# EasyEDA schematic 8 Outputs Card with I2C.json
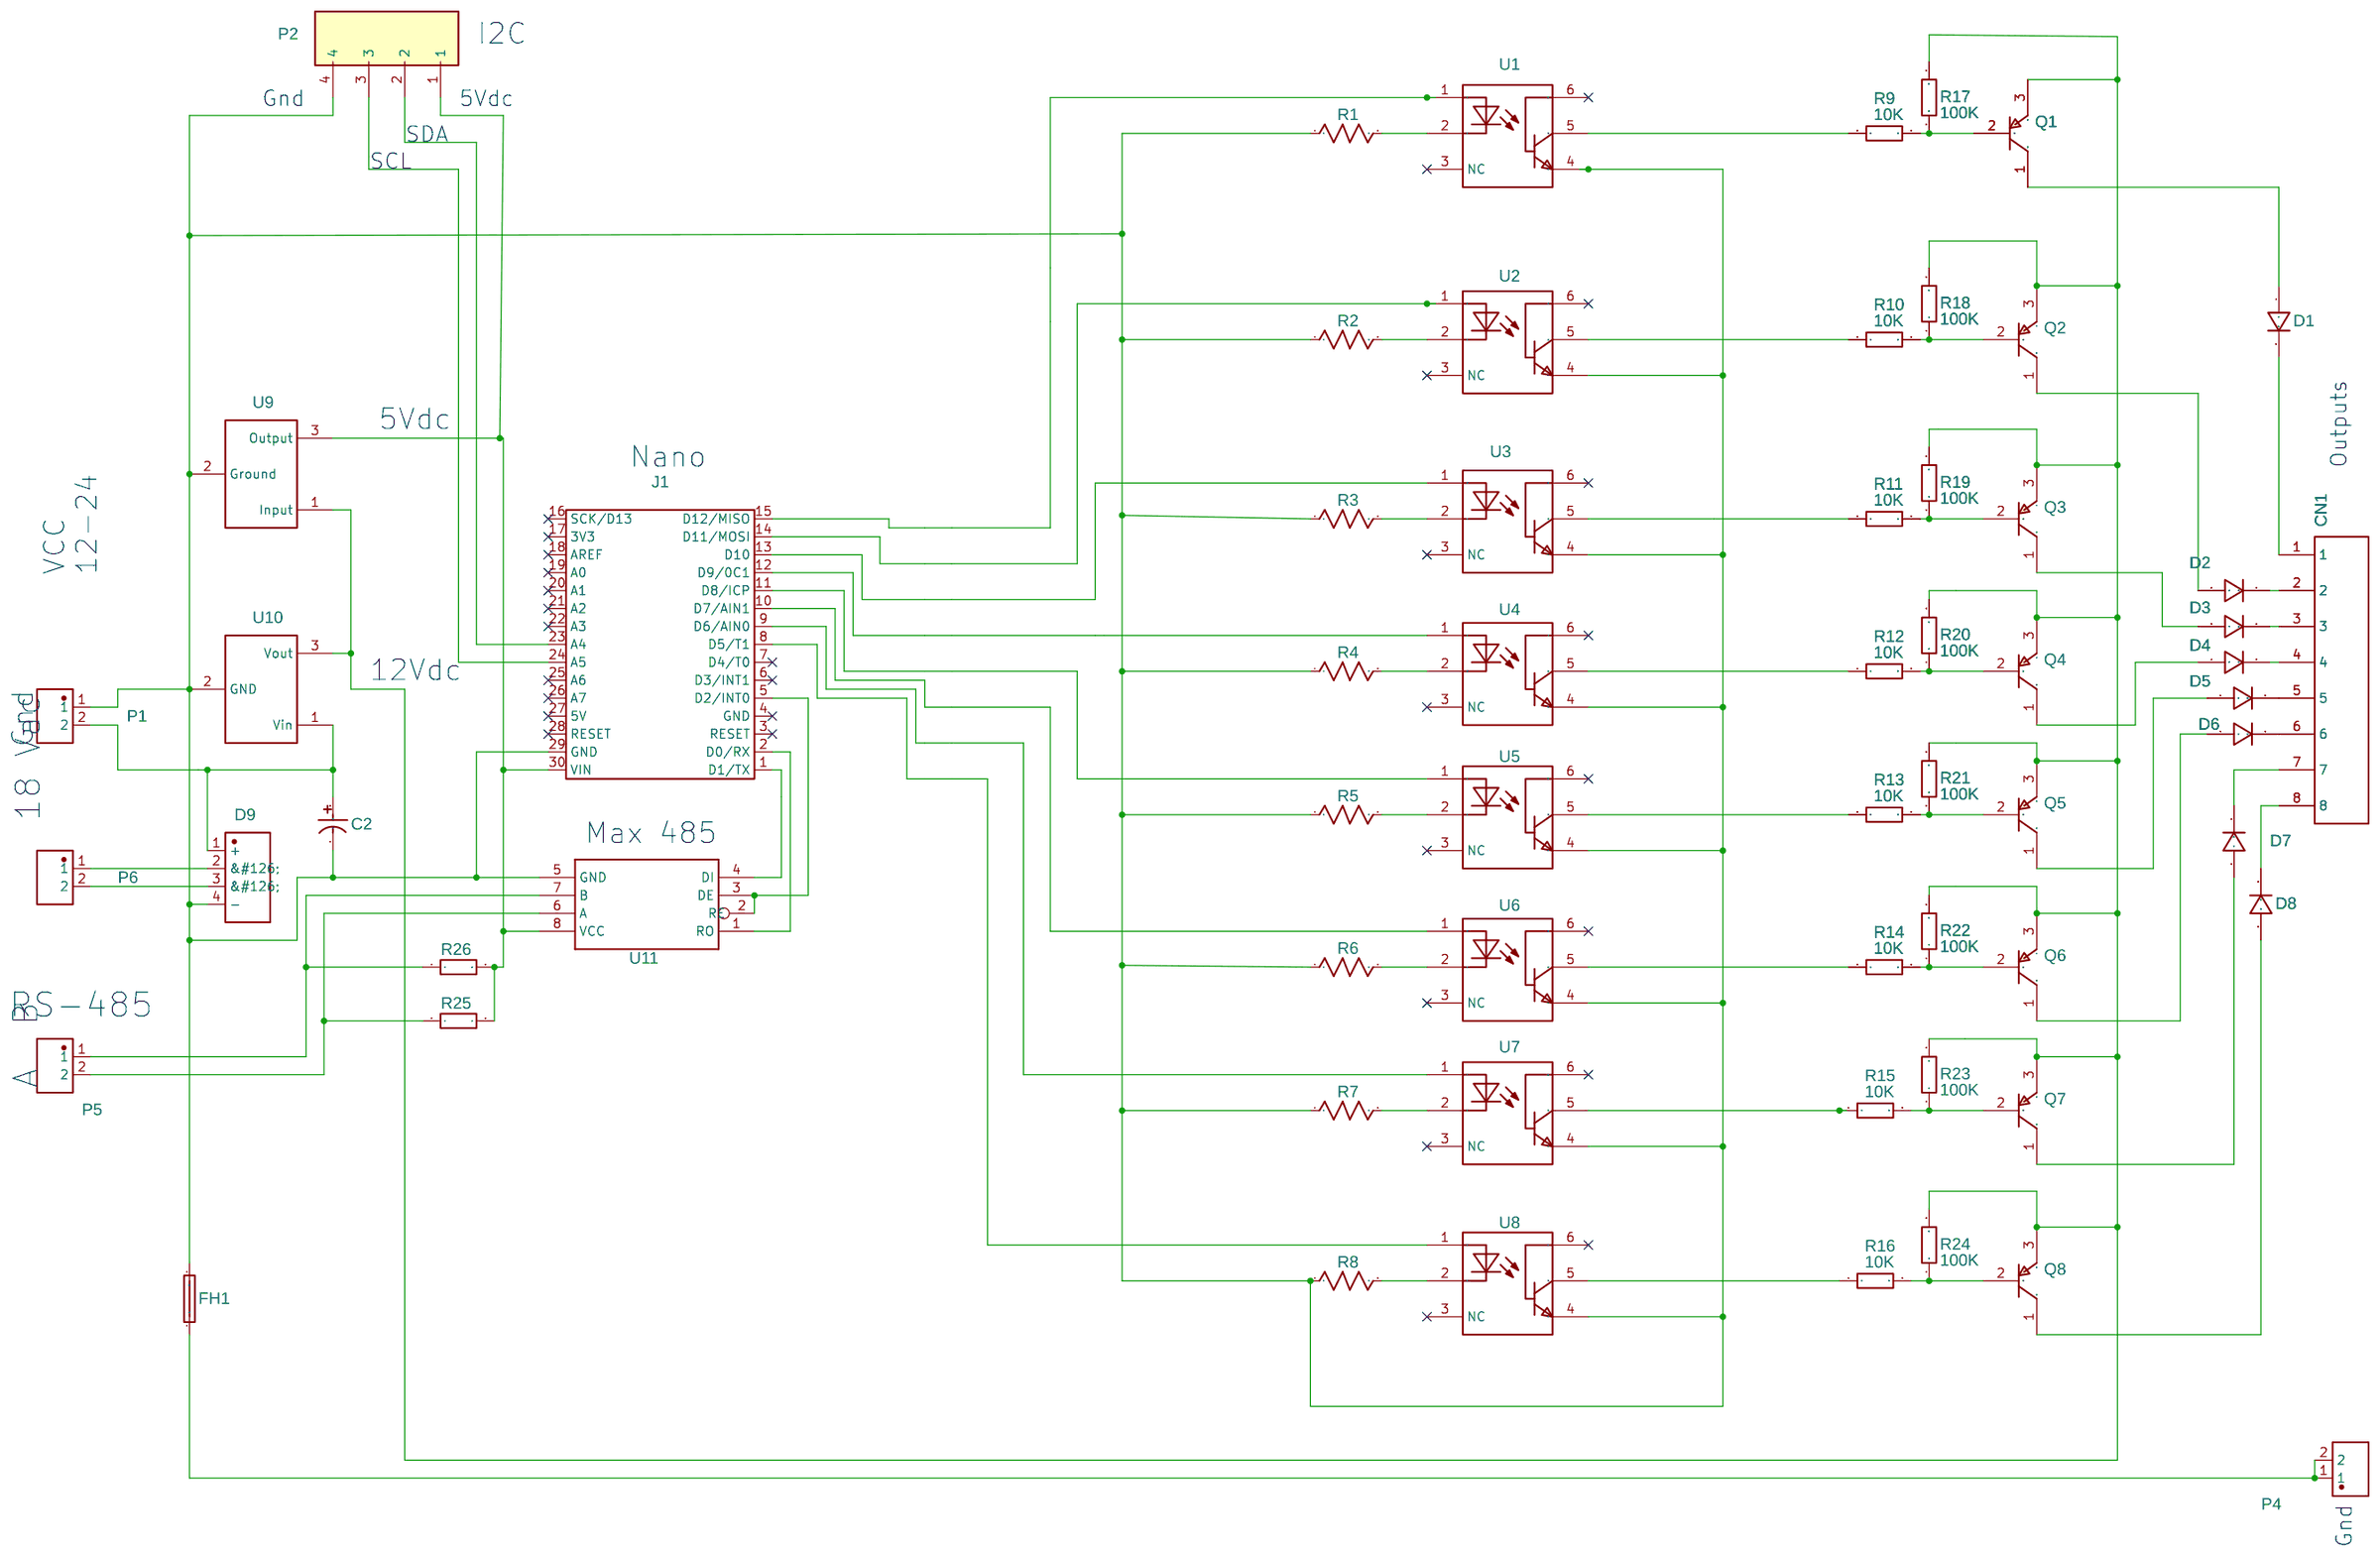
[diagram p0: schematic sheet]

## Parts
C2  470uF  [CAP-TH_BD16.0-P7.50-D1.2-FD]
CN1  WJ25C-B-7.62-8P-13-00A  [WJ25C-B-7.62-8P]
D1  1N4001  [DO-41]
D2  1N4001  [DO-41]
D3  1N4001  [DO-41]
D4  1N4001  [DO-41]
D5  1N4001  [DO-41]
D6  1N4001  [DO-41]
D7  1N4001  [DO-41]
D8  1N4001  [DO-41]
D9  D50SB100  [DIO-BG-TH_DXXSBXX]
FH1  64600001003  [FUSE-2P-25.8X9.0]
J1  Arduino_Nano_Header  [DIP-30_L43.18-W15.24-ARDUINONANO]
P1  WJ25C-B-2P  [CONN-TH_2P-P7.62_WJ25C-B-7.62-2P]
P2  WJ25C-B-4P  [WJ25C-B-7.62-4P]
P4  WJ25C-B-2P  [CONN-TH_2P-P7.62_WJ25C-B-7.62-2P]
P5  WJ25C-B-2P  [CONN-TH_2P-P7.62_WJ25C-B-7.62-2P]
P6  WJ25C-B-2P  [CONN-TH_2P-P7.62_WJ25C-B-7.62-2P]
Q1  2N4033  [TO-39-3]
Q2  2N4033  [TO-39-3]
Q3  2N4033  [TO-39-3]
Q4  2N4033  [TO-39-3]
Q5  2N4033  [TO-39-3]
Q6  2N4033  [TO-39-3]
Q7  2N4033  [TO-39-3]
Q8  2N4033  [TO-39-3]
R1  1k  [AXIAL-0.3]
R2  1k  [AXIAL-0.3]
R3  1k  [AXIAL-0.3]
R4  1k  [AXIAL-0.3]
R5  1k  [AXIAL-0.3]
R6  1k  [AXIAL-0.3]
R7  1k  [AXIAL-0.3]
R8  1k  [AXIAL-0.3]
R9  10K  [RES-TH_BD2.2-L6.5-P10.50-D0.6]
R10  10K  [RES-TH_BD2.2-L6.5-P10.50-D0.6]
R11  10K  [RES-TH_BD2.2-L6.5-P10.50-D0.6]
R12  10K  [RES-TH_BD2.2-L6.5-P10.50-D0.6]
R13  10K  [RES-TH_BD2.2-L6.5-P10.50-D0.6]
R14  10K  [RES-TH_BD2.2-L6.5-P10.50-D0.6]
R15  10K  [RES-TH_BD2.2-L6.5-P10.50-D0.6]
R16  10K  [RES-TH_BD2.2-L6.5-P10.50-D0.6]
R17  100K  [RES-TH_BD2.2-L6.5-P10.50-D0.6]
R18  100K  [RES-TH_BD2.2-L6.5-P10.50-D0.6]
R19  100K  [RES-TH_BD2.2-L6.5-P10.50-D0.6]
R20  100K  [RES-TH_BD2.2-L6.5-P10.50-D0.6]
R21  100K  [RES-TH_BD2.2-L6.5-P10.50-D0.6]
R22  100K  [RES-TH_BD2.2-L6.5-P10.50-D0.6]
R23  100K  [RES-TH_BD2.2-L6.5-P10.50-D0.6]
R24  100K  [RES-TH_BD2.2-L6.5-P10.50-D0.6]
R25  10K  [AXIAL-0.4]
R26  10K  [AXIAL-0.4]
U1  4N25M  [DIP-6]
U2  4N25M  [DIP-6]
U3  4N25M  [DIP-6]
U4  4N25M  [DIP-6]
U5  4N25M  [DIP-6]
U6  4N25M  [DIP-6]
U7  4N25M  [DIP-6]
U8  4N25M  [DIP-6]
U9  MC7805BTG  [TO-220-3_L10.0-W4.5-P2.54-L]
U10  CJ7812  [TO-220-3_L10.0-W4.5-P2.54-L]
U11  MAX485DIL  [DIP8]

## Library data of the parts
C2 = 470uF 100V 16*25: Supplier: LCSC; Manufacturer: ValuePro; Supplier Part: C72551
CN1 = -: Supplier: LCSC; Manufacturer: ReliaPro; image: //image.lceda.cn/szlcsc/C49492.jpg; Supplier Part: C49492
D1-D8 = -: Supplier Part: C169150; Supplier: LCSC; Manufacturer: DIOFIT; Contributor: LCSC
D9 = -: Supplier: LCSC; Supplier Part: C411148; Manufacturer: Leshan Radio; Contributor: LCSC
FH1 = -: Supplier: LCSC; Supplier Part: C206887; Manufacturer: Littelfuse; Contributor: LCSC
P1 P4-P6 = -: Supplier: LCSC; Manufacturer: ReliaPro; image: //image.lceda.cn/szlcsc/C8422.jpg; Supplier Part: C8422
P2 = WJ25C-B-4P: Supplier: LCSC; Manufacturer: ReliaPro; image: //image.lceda.cn/szlcsc/C8424.jpg; Supplier Part: C8424
Q1-Q8 = -: TRANS PNP 30V 0.1A TO-92; Supplier: Mouser; Supplier Part: 610-2N4033; Manufacturer: Central Semiconductor
R1 = Res_AXIAL-0.3(1/8W)_US: Manufacturer Part: MFR0W4F1001A50; Supplier: LCSC; Supplier Part: C57435; Manufacturer: Uniroyal Elec
R2-R8 = Res_AXIAL-0.3(1/8W)_US: Manufacturer Part: MFR0W4F1001A50; Supplier Part: C57435; Supplier: LCSC; Manufacturer: Uniroyal Elec
R9-R16 R25 R26 = CFR0W4J0103A50: Supplier: LCSC; Manufacturer: UniOhm; Supplier Part: C61299
R17-R24 = CFR0W4J0104A50: Supplier: LCSC; Manufacturer: UniOhm; Supplier Part: C61303
U1-U8 = -: Supplier: LCSC; Manufacturer: FAIRCHILD; image: //image.lceda.cn/szlcsc/C5241.jpg; Supplier Part: C5241
U9 = -: Supplier: LCSC; Manufacturer: ON; image: //image.lceda.cn/szlcsc/C45385.jpg; Supplier Part: C45385
U10 = -: Supplier: LCSC; Manufacturer: CJ; image: //image.lceda.cn/szlcsc/C77894.jpg; Supplier Part: C77894
U11 = -: RS-485 transceiver; Contributor: SparkFun

## Nets
Net-(C2-1): C2.1 D9.1(+) P1.2 U10.1(Vin)
Net-(C2-2): C2.2 D9.4(-) FH1.2 J1.29(GND) P1.1 P2.4 R1.1 R2.1 R3.1 R4.1 R5.1 R6.1 R7.1 R8.1 U1.4 U2.4 U3.4 U4.4 U5.4 U6.4 U7.4 U8.4 U9.2(Ground) U10.2(GND) U11.5(GND)
Net-(CN1-1): CN1.1 D1.2
Net-(CN1-2): CN1.2 D2.2
Net-(CN1-3): CN1.3 D3.2
Net-(CN1-4): CN1.4 D4.2
Net-(CN1-5): CN1.5 D5.2
Net-(CN1-6): CN1.6 D6.2
Net-(CN1-7): CN1.7 D7.2
Net-(CN1-8): CN1.8 D8.2
Net-(D1-1): D1.1 Q1.1(C)
Net-(D2-1): D2.1 Q2.1(C)
Net-(D3-1): D3.1 Q3.1(C)
Net-(D4-1): D4.1 Q4.1(C)
Net-(D5-1): D5.1 Q5.1(C)
Net-(D6-1): D6.1 Q6.1(C)
Net-(D7-1): D7.1 Q7.1(C)
Net-(D8-1): D8.1 Q8.1(C)
Net-(D9-2): D9.2(&#126;) P6.1
Net-(D9-3): D9.3(&#126;) P6.2
Net-(FH1-1): FH1.1 P4.1 P4.2
Net-(J1-1): J1.1(D1/TX) U11.4(DI)
Net-(J1-2): J1.2(D0/RX) U11.1(RO)
Net-(J1-5): J1.5(D2/INT0) U11.2(RE) U11.3(DE)
Net-(J1-8): J1.8(D5/T1) U8.1
Net-(J1-9): J1.9(D6/AIN0) U7.1
Net-(J1-10): J1.10(D7/AIN1) U6.1
Net-(J1-11): J1.11(D8/ICP) U5.1
Net-(J1-12): J1.12(D9/0C1) U4.1
Net-(J1-13): J1.13(D10) U3.1
Net-(J1-14): J1.14(D11/MOSI) U2.1
Net-(J1-15): J1.15(D12/MISO) U1.1
Net-(J1-23): J1.23(A4) P2.2
Net-(J1-24): J1.24(A5) P2.3
Net-(J1-30): J1.30(VIN) P2.1 R25.2 R26.2 U9.3(Output) U11.8(VCC)
Net-(P5-1): P5.1 R26.1 U11.7(B)
Net-(P5-2): P5.2 R25.1 U11.6(A)
Net-(Q1-2): Q1.2(B) R9.2 R17.1
Net-(Q1-3): Q1.3(E) Q2.3(E) Q3.3(E) Q4.3(E) Q5.3(E) Q6.3(E) Q7.3(E) Q8.3(E) R17.2 R18.2 R19.2 R20.2 R21.2 R22.2 R23.2 R24.2 U9.1(Input) U10.3(Vout)
Net-(Q2-2): Q2.2(B) R10.2 R18.1
Net-(Q3-2): Q3.2(B) R11.2 R19.1
Net-(Q4-2): Q4.2(B) R12.2 R20.1
Net-(Q5-2): Q5.2(B) R13.2 R21.1
Net-(Q6-2): Q6.2(B) R14.2 R22.1
Net-(Q7-2): Q7.2(B) R15.2 R23.1
Net-(Q8-2): Q8.2(B) R16.2 R24.1
Net-(R1-2): R1.2 U1.2
Net-(R2-2): R2.2 U2.2
Net-(R3-2): R3.2 U3.2
Net-(R4-2): R4.2 U4.2
Net-(R5-2): R5.2 U5.2
Net-(R6-2): R6.2 U6.2
Net-(R7-2): R7.2 U7.2
Net-(R8-2): R8.2 U8.2
Net-(R9-1): R9.1 U1.5
Net-(R10-1): R10.1 U2.5
Net-(R11-1): R11.1 U3.5
Net-(R12-1): R12.1 U4.5
Net-(R13-1): R13.1 U5.5
Net-(R14-1): R14.1 U6.5
Net-(R15-1): R15.1 U7.5
Net-(R16-1): R16.1 U8.5

Not connected (* = marked no-connect by the designer): J1 3(RESET)* 4(GND)* 6(D3/INT1)* 7(D4/T0)* 16(SCK/D13)* 17(3V3)* 18(AREF)* 19(A0)* 20(A1)* 21(A2)* 22(A3)* 25(A6)* 26(A7)* 27(5V)* 28(RESET)*; U1 3(NC)* 6*; U2 3(NC)* 6*; U3 3(NC)* 6*; U4 3(NC)* 6*; U5 3(NC)* 6*; U6 3(NC)* 6*; U7 3(NC)* 6*; U8 3(NC)* 6*

## Notes on the sheet
- I2C
- Gnd
- 5Vdc
- SDA
- SCL
- 5Vdc
- Nano
- Outputs
- VCC
  12-24
- 12Vdc
- Gnd
- Max 485
- 18 Vac
- RS-485
- B
- A
- Gnd
